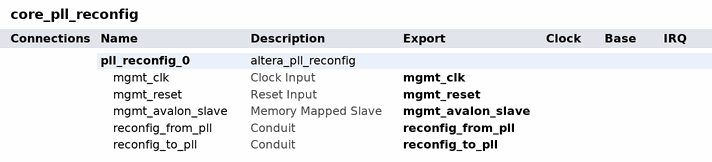
[diagram p0: system contents]
# Platform Designer (Qsys) system core_pll_reconfig, Arria 10 10AX115S4F45E3SGE3
# Parameters at their usual value, and those the tool derives, are not listed.
package require -exact qsys 16.0
create_system core_pll_reconfig
set_project_property DEVICE_FAMILY {Arria 10}
set_project_property DEVICE 10AX115S4F45E3SGE3

add_instance pll_reconfig_0 altera_pll_reconfig 16.0
set_instance_property pll_reconfig_0 AUTO_EXPORT true

# exported interfaces
add_interface mgmt_avalon_slave avalon slave
set_interface_property mgmt_avalon_slave EXPORT_OF pll_reconfig_0.mgmt_avalon_slave
add_interface mgmt_clk clock sink
set_interface_property mgmt_clk EXPORT_OF pll_reconfig_0.mgmt_clk
add_interface mgmt_reset reset sink
set_interface_property mgmt_reset EXPORT_OF pll_reconfig_0.mgmt_reset
add_interface reconfig_from_pll conduit end
set_interface_property reconfig_from_pll EXPORT_OF pll_reconfig_0.reconfig_from_pll
add_interface reconfig_to_pll conduit end
set_interface_property reconfig_to_pll EXPORT_OF pll_reconfig_0.reconfig_to_pll

set_interconnect_requirement {$system} qsys_mm.clockCrossingAdapter HANDSHAKE
set_interconnect_requirement {$system} qsys_mm.enableEccProtection FALSE
set_interconnect_requirement {$system} qsys_mm.insertDefaultSlave FALSE
set_interconnect_requirement {$system} qsys_mm.maxAdditionalLatency 1

save_system core_pll_reconfig.qsys
